# Altium schematic sheet 8_Arm.SchDoc
size A
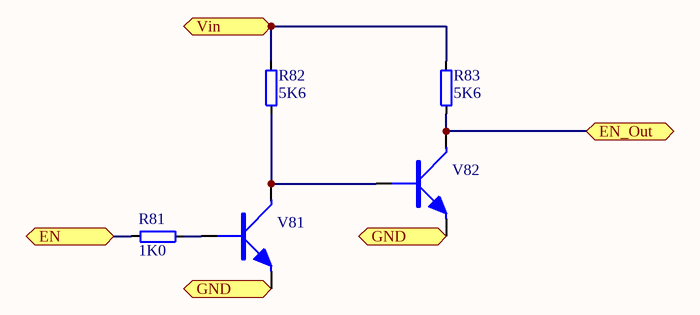
[diagram p0: 8_Arm.SchDoc]

## Parts
R81  1K0  [0805]
R82  5K6  [0805]
R83  5K6  [0805]
V81  BC846B  [SOT23]  (value not drawn)
V82  BC846B  [SOT23]  (value not drawn)

## Ports
EN, EN_Out, GND, Vin

## Nets
EN: R81.1 ; port EN
EN_Out: R83.1 V82.x(Collector) ; port EN_Out
GND: V81.y(Emitter) V82.y(Emitter) ; port GND
Vin: R82.2 R83.2 ; port Vin
NetR81_2: R81.2 V81.z(Base)
NetR82_1: R82.1 V81.x(Collector) V82.z(Base)

## Library data of the parts
R81 = 3674: Resistor; Part Field 1: RES 1K0 1% 125mW 0805 RoHS; Manufacturer: Phycomp; PartNumber: RC0805FR-071KL; IPN: 3674; EndOfLife: Active EOL:Jan 2023; Characteristics: 100ppm/C -55..+155C U=150Vrms Reel=5000pcs; OrderNumber: 232273461002L; Lead_Process_Compatible: Yes; SubmittedBy: ART; DeviceRank: 2; Part Field 2: Phycomp RC0805FR-071KL; ComponentLink1Description: Phycomp_RC0805series_DS.pdf; ComponentLink2Description: Phycomp_Generic_RCS.pdf; ComponentLink1URL: http://ecad.vsl.com.au/apps/BomGen/Data/rel/datasheets/new_parts/Phycomp_RC0805series_DS.pdf; ComponentLink2URL: http://ecad.vsl.com.au/apps/BomGen/Data/rel/rohs_compliance/new_certificates/Phycomp_Generic_RCS.pdf; Altium_Comment_Old: RES 1K0 1% 125mW 0805 RoHS; Altium_Comment: 1K0; Symbol: RES; Supplier1: Arrow; Supplier1_PartNumber: RC0805FR-071KL; Supplier2: Xon; IPN_Search: 3674; PartType: PCB; CheckedBy: ART; Price_5000: M$0.003
R82 R83 = 3692: Resistor; Part Field 1: RES 5K6 1% 125mW 0805 RoHS; Manufacturer: Phycomp; PartNumber: RC0805FR-075K6L; IPN: 3692; EndOfLife: Active EOL:Jan 2023; Characteristics: 100ppm/C -55..+155C U=150Vrms Reel=5000pcs; OrderNumber: 232273465602L; Lead_Process_Compatible: Yes; SubmittedBy: ART; DeviceRank: 2; Part Field 2: Phycomp RC0805FR-075K6L; ComponentLink1Description: Phycomp_RC0805series_DS.pdf; ComponentLink2Description: Phycomp_Generic_RCS.pdf; ComponentLink1URL: http://ecad.vsl.com.au/apps/BomGen/Data/rel/datasheets/new_parts/Phycomp_RC0805series_DS.pdf; ComponentLink2URL: http://ecad.vsl.com.au/apps/BomGen/Data/rel/rohs_compliance/new_certificates/Phycomp_Generic_RCS.pdf; Altium_Comment_Old: RES 5K6 1% 125mW 0805 RoHS; Altium_Comment: 5K6; Symbol: RES; Supplier1: Arrow; Supplier1_PartNumber: RC0805FR-075K6L; Supplier2: Xon; IPN_Search: 3692; PartType: PCB; CheckedBy: ART; Price_5000: M$0.003
V81 V82 = 3412: NPN Transistor SOT23; Part Field 1: BJT NPN BC846 SOT23 RoHS; Manufacturer: NXP; IPN: 3412; EndOfLife: Active EOL:Nov 2023; Characteristics: Ic=100mA Vceo=65V Pt=250mW Tj=150degC Hfe=200..450; OrderNumber: 9335 895 60215; Lead_Process_Compatible: Yes; SubmittedBy: ART; DeviceRank: 1; Part Field 2: NXP BC846B; ComponentLink1Description: NXP_BC84xseries_DS.pdf; ComponentLink2Description: NXP_BC846B_MD.xls; ComponentLink1URL: http://ecad.vsl.com.au/apps/BomGen/Data/rel/datasheets/new_parts/NXP_BC84xseries_DS.pdf; ComponentLink2URL: Not Found; Altium_Comment_Old: BJT NPN BC846 SOT23 RoHS; Altium_Comment: BC846B; Symbol: NPN-SOT23; PartNumber: BC846B; LastChanged: 24/08/09 11:56:43; Supplier1: Mouser; Supplier1_PartNumber: 771-BC846B-T/R; Supplier2: Digikey; Supplier2_PartNumber: 568-1632-1-ND; IPN_Search: 3412; PartType: PCB; CheckedBy: LZZ; Price_100: M$0.040; Price_1000: M$0.027; Price_5000: M$0.020